# EAGLE schematic Mini Sumo (EAGLE 7.6.0)
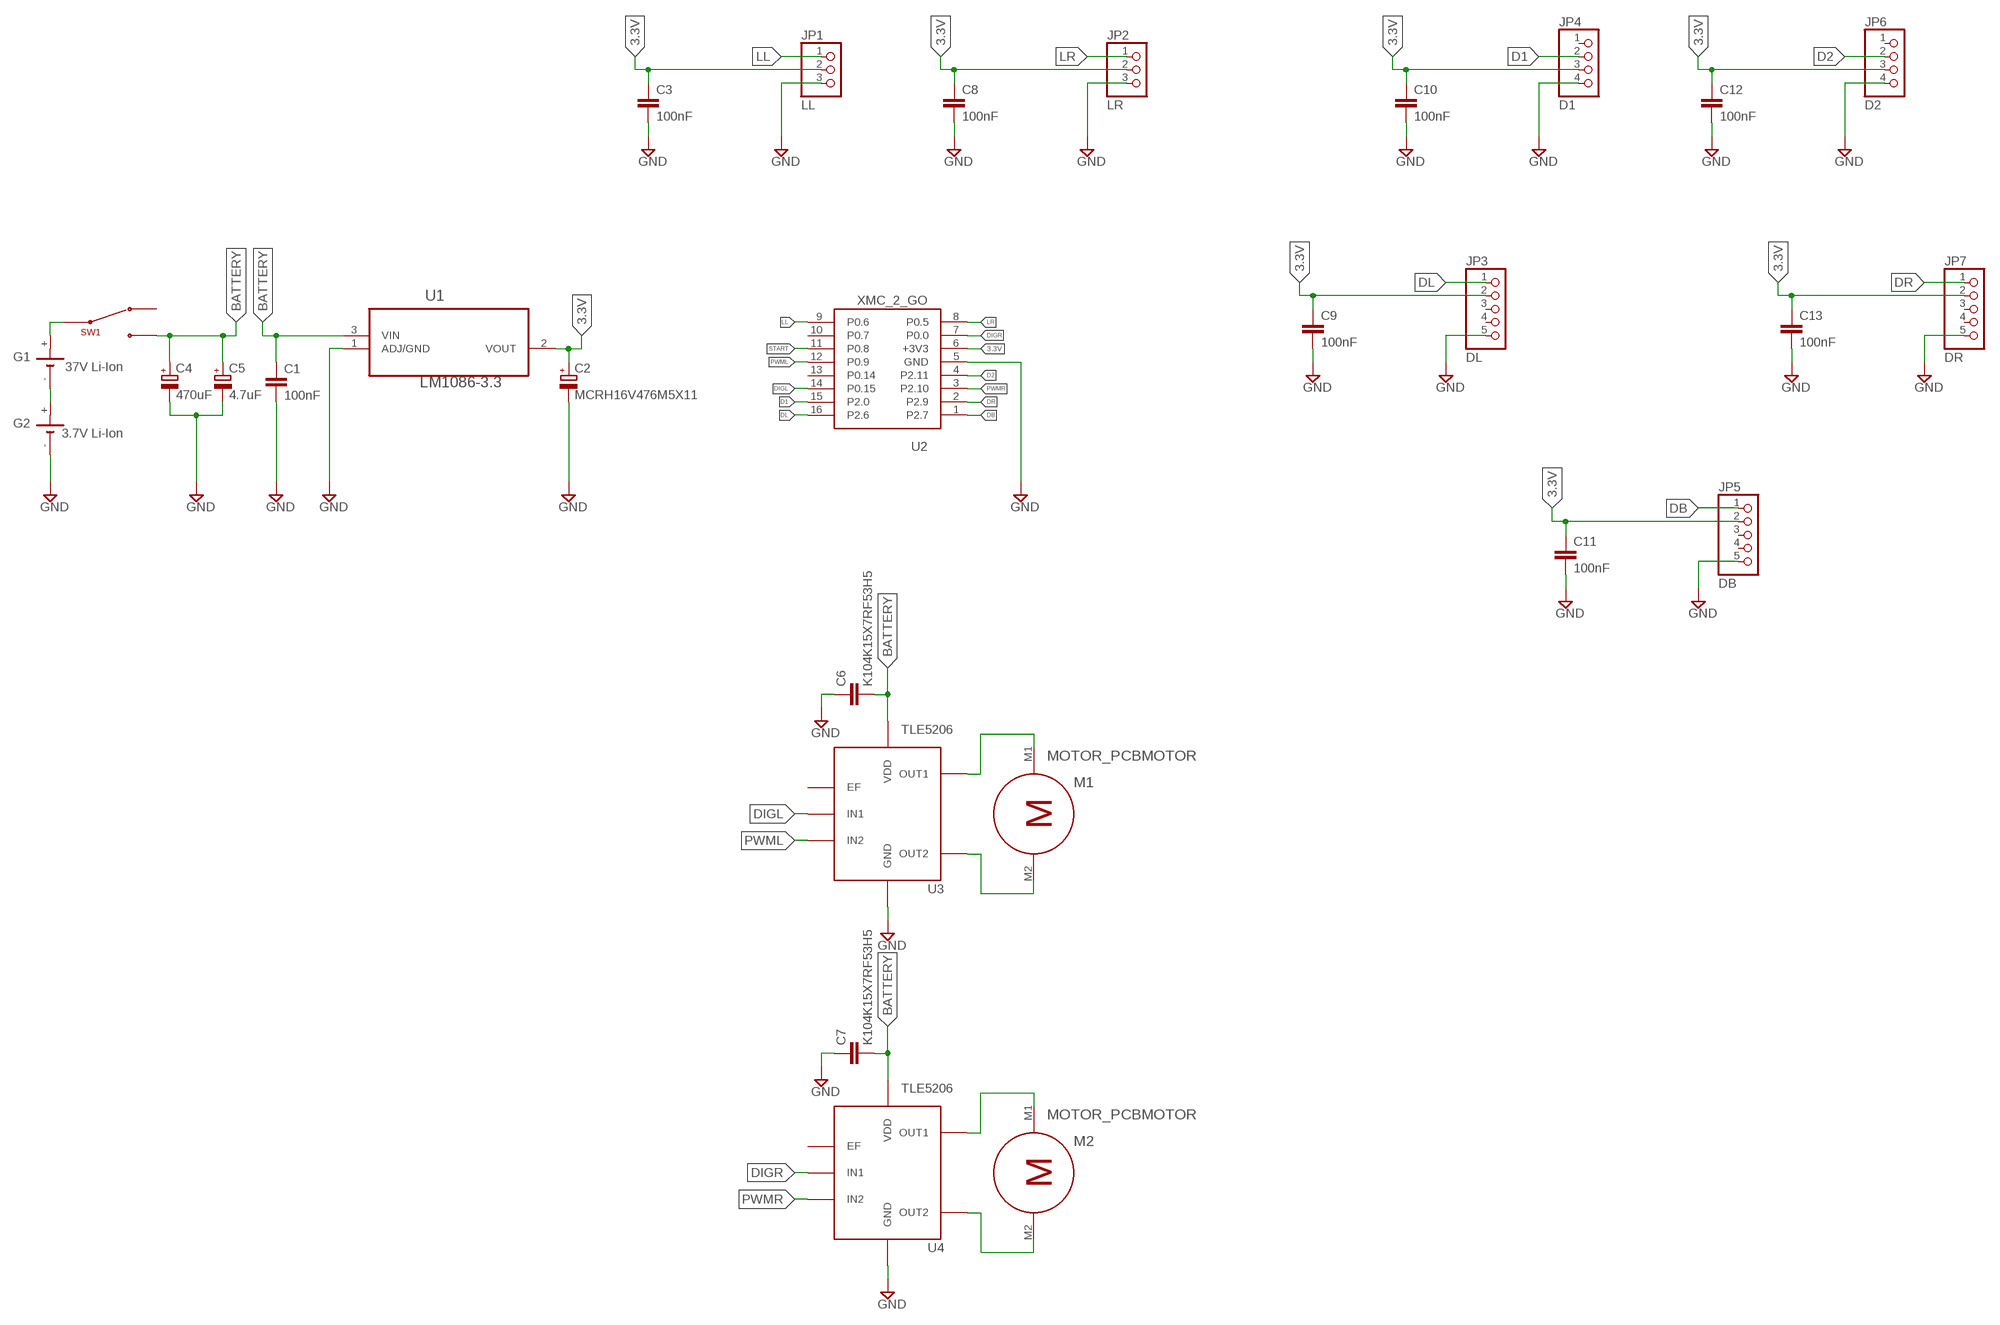
[diagram p0: schematic, sheet 1]

## Parts
C1  100nF  C-EU025-025X050  [C025-025X050]
C2  MCRH16V476M5X11  CPOL-EUE2.5-5  [E2,5-5]
C3  100nF  C-EU025-025X050  [C025-025X050]
C4  470uF  CPOL-EUE2.5-5  [E2,5-5]
C5  4.7uF  CPOL-EUE2.5-5  [E2,5-5]
C6  K104K15X7RF53H5  C-EU025-025X050  [C025-025X050]
C7  K104K15X7RF53H5  C-EU025-025X050  [C025-025X050]
C8  100nF  C-EU025-025X050  [C025-025X050]
C9  100nF  C-EU025-025X050  [C025-025X050]
C10  100nF  C-EU025-025X050  [C025-025X050]
C11  100nF  C-EU025-025X050  [C025-025X050]
C12  100nF  C-EU025-025X050  [C025-025X050]
C13  100nF  C-EU025-025X050  [C025-025X050]
G1  37V Li-Ion  CH291-1220LF  [CH291-1220LF]
G2  3.7V Li-Ion  CH291-1220LF  [CH291-1220LF]
JP1  LL  PINHD-1X3  [1X03]
JP2  LR  PINHD-1X3  [1X03]
JP3  DL  PINHD-1X5  [1X05]
JP4  D1  PINHD-1X4  [1X04]
JP5  DB  PINHD-1X5  [1X05]
JP6  D2  PINHD-1X4  [1X04]
JP7  DR  PINHD-1X5  [1X05]
M1  MOTOR_PCBMOTOR  [MICRO-MOTOR]
M2  MOTOR_PCBMOTOR  [MICRO-MOTOR]
SW1  SWITCH1OFF2  [MS111]
U1  LM1086-3.3  LM1086CT-5.0  [TO254P470X1016X2222-3P]
U2  XMC_2_GO  [XMC_2_GO]
U3  TLE5206  [INF-PG-TO263-7-1_L_1PRIMARY]
U4  TLE5206  [INF-PG-TO263-7-1_L_1PRIMARY]

## Nets
3.3V: C2.+ C3.1 C8.1 C9.1 C10.1 C11.1 C12.1 C13.1 JP1.2 JP2.2 JP3.2 JP4.3 JP5.2 JP6.3 JP7.2 U1.2(VOUT) U2.6(+3V3)
BATTERY: C1.1 C4.+ C5.+ C6.2 C7.2 SW1.P$3 U1.3(VIN) U3.6(VDD) U4.6(VDD)
D1: JP4.2 U2.15(P2.0)
D2: JP6.2 U2.4(P2.11)
DB: JP5.1 U2.1(P2.7)
DIGL: U2.14(P0.15) U3.3(IN1)
DIGR: U2.7(P0.0) U4.3(IN1)
DL: JP3.1 U2.16(P2.6)
DR: JP7.1 U2.2(P2.9)
GND: C1.2 C2.- C3.2 C4.- C5.- C6.1 C7.1 C8.2 C9.2 C10.2 C11.2 C12.2 C13.2 G2.- JP1.3 JP2.3 JP3.5 JP4.4 JP5.5 JP6.4 JP7.5 U1.1(ADJ/GND) U2.5(GND) U3.4(GND) U3.8(GND) U4.4(GND) U4.8(GND)
LL: JP1.1 U2.9(P0.6)
LR: JP2.1 U2.8(P0.5)
N$1: G1.- G2.+
N$2: G1.+ SW1.P$2(COM)
N$15: M1.M1 U3.1(OUT1)
N$16: M1.M2 U3.7(OUT2)
N$18: M2.M1 U4.1(OUT1)
N$19: M2.M2 U4.7(OUT2)
PWML: U2.12(P0.9) U3.5(IN2)
PWMR: U2.3(P2.10) U4.5(IN2)
START: U2.11(P0.8)
Unconnected: JP3.3 JP3.4 JP4.1 JP5.3 JP5.4 JP6.1 JP7.3 JP7.4 SW1.P$1 U2.10(P0.7) U2.13(P0.14) U3.2(EF) U4.2(EF)

## Library data of the parts
C1 C3 C6-C13 = resistor:C-EU: CAPACITOR, European symbol
C2 C4 C5 = resistor:CPOL-EU: POLARIZED CAPACITOR, European symbol
G1 G2 = battery:CH291-1220LF: Battery Holder, SMT, 12mm multicomp PART NO. CH291-1220LF Source: Data sheet <http://www.farnell.com/datasheets/1505860.pdf>
JP1 JP2 = pinhead:PINHD-1X3: PIN HEADER
JP3 JP5 JP7 = pinhead:PINHD-1X5: PIN HEADER
JP4 JP6 = pinhead:PINHD-1X4: PIN HEADER
M1 M2 = Line_Follower_LIBV3:MOTOR
SW1 = Line_Follower_LIBV3.1:SWITCH1OFF2
U1 = LM1086CT-5.0:LM1086CT-5.0: IC, LDO VOLT REG, 5V, 1.5A; MPN: LM1086CT-5.0; OC_FARNELL: 1685486; OC_NEWARK: 41K3396; PACKAGE: TO-220; SUPPLIER: National Semiconductor
U2 = Line_Follower_LIBV3.1:XMC_2_GO
U3 U4 = Line_Follower_LIBV3:TLE5206